# Altium schematic sheet Pressure_SENSOR.SchDoc
size A4
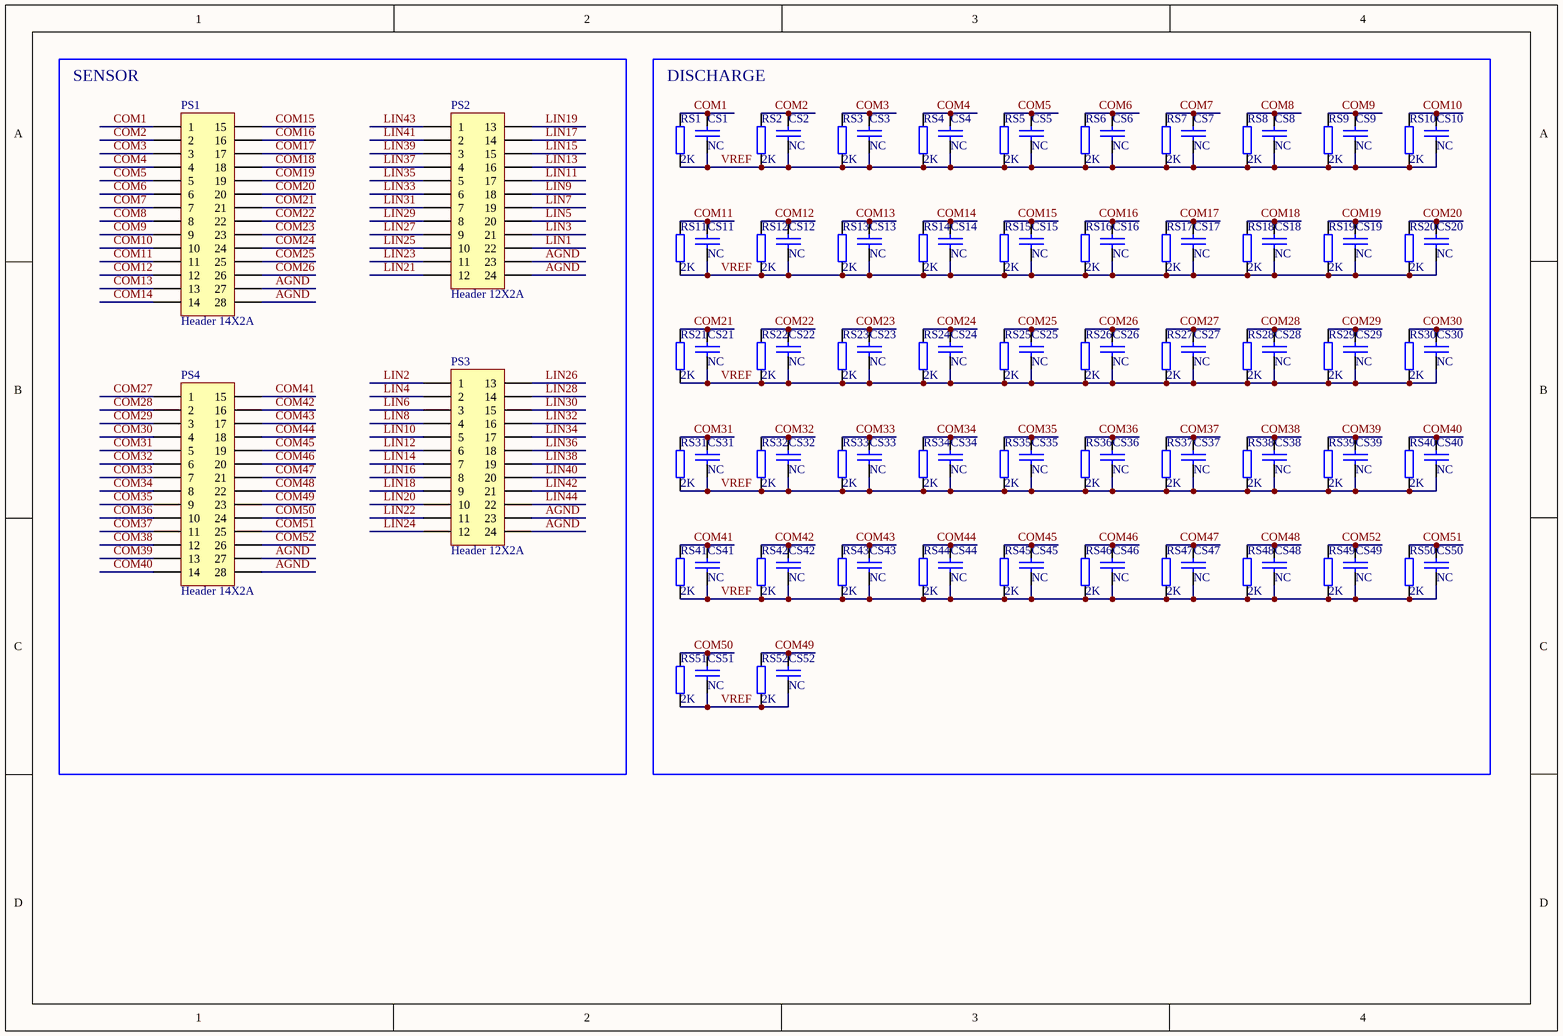
[diagram p0: Pressure_SENSOR.SchDoc]

## Parts
CS1  NC  [c0603_HSC100]
CS2  NC  [c0603_HSC100]
CS3  NC  [c0603_HSC100]
CS4  NC  [c0603_HSC100]
CS5  NC  [c0603_HSC100]
CS6  NC  [c0603_HSC100]
CS7  NC  [c0603_HSC100]
CS8  NC  [c0603_HSC100]
CS9  NC  [c0603_HSC100]
CS10  NC  [c0603_HSC100]
CS11  NC  [c0603_HSC100]
CS12  NC  [c0603_HSC100]
CS13  NC  [c0603_HSC100]
CS14  NC  [c0603_HSC100]
CS15  NC  [c0603_HSC100]
CS16  NC  [c0603_HSC100]
CS17  NC  [c0603_HSC100]
CS18  NC  [c0603_HSC100]
CS19  NC  [c0603_HSC100]
CS20  NC  [c0603_HSC100]
CS21  NC  [c0603_HSC100]
CS22  NC  [c0603_HSC100]
CS23  NC  [c0603_HSC100]
CS24  NC  [c0603_HSC100]
CS25  NC  [c0603_HSC100]
CS26  NC  [c0603_HSC100]
CS27  NC  [c0603_HSC100]
CS28  NC  [c0603_HSC100]
CS29  NC  [c0603_HSC100]
CS30  NC  [c0603_HSC100]
CS31  NC  [c0603_HSC100]
CS32  NC  [c0603_HSC100]
CS33  NC  [c0603_HSC100]
CS34  NC  [c0603_HSC100]
CS35  NC  [c0603_HSC100]
CS36  NC  [c0603_HSC100]
CS37  NC  [c0603_HSC100]
CS38  NC  [c0603_HSC100]
CS39  NC  [c0603_HSC100]
CS40  NC  [c0603_HSC100]
CS41  NC  [c0603_HSC100]
CS42  NC  [c0603_HSC100]
CS43  NC  [c0603_HSC100]
CS44  NC  [c0603_HSC100]
CS45  NC  [c0603_HSC100]
CS46  NC  [c0603_HSC100]
CS47  NC  [c0603_HSC100]
CS48  NC  [c0603_HSC100]
CS49  NC  [c0603_HSC100]
CS50  NC  [c0603_HSC100]
CS51  NC  [c0603_HSC100]
CS52  NC  [c0603_HSC100]
PS1  Header 14X2A  [FPC-1.0-26]
PS2  Header 12X2A  [FPC-1.0-22]
PS3  Header 12X2A  [FPC-1.0-22]
PS4  Header 14X2A  [FPC-1.0-26]
RS1  2K  [R0603_HSC100]
RS2  2K  [R0603_HSC100]
RS3  2K  [R0603_HSC100]
RS4  2K  [R0603_HSC100]
RS5  2K  [R0603_HSC100]
RS6  2K  [R0603_HSC100]
RS7  2K  [R0603_HSC100]
RS8  2K  [R0603_HSC100]
RS9  2K  [R0603_HSC100]
RS10  2K  [R0603_HSC100]
RS11  2K  [R0603_HSC100]
RS12  2K  [R0603_HSC100]
RS13  2K  [R0603_HSC100]
RS14  2K  [R0603_HSC100]
RS15  2K  [R0603_HSC100]
RS16  2K  [R0603_HSC100]
RS17  2K  [R0603_HSC100]
RS18  2K  [R0603_HSC100]
RS19  2K  [R0603_HSC100]
RS20  2K  [R0603_HSC100]
RS21  2K  [R0603_HSC100]
RS22  2K  [R0603_HSC100]
RS23  2K  [R0603_HSC100]
RS24  2K  [R0603_HSC100]
RS25  2K  [R0603_HSC100]
RS26  2K  [R0603_HSC100]
RS27  2K  [R0603_HSC100]
RS28  2K  [R0603_HSC100]
RS29  2K  [R0603_HSC100]
RS30  2K  [R0603_HSC100]
RS31  2K  [R0603_HSC100]
RS32  2K  [R0603_HSC100]
RS33  2K  [R0603_HSC100]
RS34  2K  [R0603_HSC100]
RS35  2K  [R0603_HSC100]
RS36  2K  [R0603_HSC100]
RS37  2K  [R0603_HSC100]
RS38  2K  [R0603_HSC100]
RS39  2K  [R0603_HSC100]
RS40  2K  [R0603_HSC100]
RS41  2K  [R0603_HSC100]
RS42  2K  [R0603_HSC100]
RS43  2K  [R0603_HSC100]
RS44  2K  [R0603_HSC100]
RS45  2K  [R0603_HSC100]
RS46  2K  [R0603_HSC100]
RS47  2K  [R0603_HSC100]
RS48  2K  [R0603_HSC100]
RS49  2K  [R0603_HSC100]
RS50  2K  [R0603_HSC100]
RS51  2K  [R0603_HSC100]
RS52  2K  [R0603_HSC100]

## Blocks framed on the sheet
SENSOR: PS1-PS4
DISCHARGE: CS1-CS52 RS1-RS52

## Nets
AGND: PS1.27 PS1.28 PS2.23 PS2.24 PS3.23 PS3.24 PS4.27 PS4.28
COM1: CS1.2 PS1.1 RS1.2
COM2: CS2.2 PS1.2 RS2.2
COM3: CS3.2 PS1.3 RS3.2
COM4: CS4.2 PS1.4 RS4.2
COM5: CS5.2 PS1.5 RS5.2
COM6: CS6.2 PS1.6 RS6.2
COM7: CS7.2 PS1.7 RS7.2
COM8: CS8.2 PS1.8 RS8.2
COM9: CS9.2 PS1.9 RS9.2
COM10: CS10.2 PS1.10 RS10.2
COM11: CS11.2 PS1.11 RS11.2
COM12: CS12.2 PS1.12 RS12.2
COM13: CS13.2 PS1.13 RS13.2
COM14: CS14.2 PS1.14 RS14.2
COM15: CS15.2 PS1.15 RS15.2
COM16: CS16.2 PS1.16 RS16.2
COM17: CS17.2 PS1.17 RS17.2
COM18: CS18.2 PS1.18 RS18.2
COM19: CS19.2 PS1.19 RS19.2
COM20: CS20.2 PS1.20 RS20.2
COM21: CS21.2 PS1.21 RS21.2
COM22: CS22.2 PS1.22 RS22.2
COM23: CS23.2 PS1.23 RS23.2
COM24: CS24.2 PS1.24 RS24.2
COM25: CS25.2 PS1.25 RS25.2
COM26: CS26.2 PS1.26 RS26.2
COM27: CS27.2 PS4.1 RS27.2
COM28: CS28.2 PS4.2 RS28.2
COM29: CS29.2 PS4.3 RS29.2
COM30: CS30.2 PS4.4 RS30.2
COM31: CS31.2 PS4.5 RS31.2
COM32: CS32.2 PS4.6 RS32.2
COM33: CS33.2 PS4.7 RS33.2
COM34: CS34.2 PS4.8 RS34.2
COM35: CS35.2 PS4.9 RS35.2
COM36: CS36.2 PS4.10 RS36.2
COM37: CS37.2 PS4.11 RS37.2
COM38: CS38.2 PS4.12 RS38.2
COM39: CS39.2 PS4.13 RS39.2
COM40: CS40.2 PS4.14 RS40.2
COM41: CS41.2 PS4.15 RS41.2
COM42: CS42.2 PS4.16 RS42.2
COM43: CS43.2 PS4.17 RS43.2
COM44: CS44.2 PS4.18 RS44.2
COM45: CS45.2 PS4.19 RS45.2
COM46: CS46.2 PS4.20 RS46.2
COM47: CS47.2 PS4.21 RS47.2
COM48: CS48.2 PS4.22 RS48.2
COM49: CS52.2 PS4.23 RS52.2
COM50: CS51.2 PS4.24 RS51.2
COM51: CS50.2 PS4.25 RS50.2
COM52: CS49.2 PS4.26 RS49.2
LIN1: PS2.22
LIN2: PS3.1
LIN3: PS2.21
LIN4: PS3.2
LIN5: PS2.20
LIN6: PS3.3
LIN7: PS2.19
LIN8: PS3.4
LIN9: PS2.18
LIN10: PS3.5
LIN11: PS2.17
LIN12: PS3.6
LIN13: PS2.16
LIN14: PS3.7
LIN15: PS2.15
LIN16: PS3.8
LIN17: PS2.14
LIN18: PS3.9
LIN19: PS2.13
LIN20: PS3.10
LIN21: PS2.12
LIN22: PS3.11
LIN23: PS2.11
LIN24: PS3.12
LIN25: PS2.10
LIN26: PS3.13
LIN27: PS2.9
LIN28: PS3.14
LIN29: PS2.8
LIN30: PS3.15
LIN31: PS2.7
LIN32: PS3.16
LIN33: PS2.6
LIN34: PS3.17
LIN35: PS2.5
LIN36: PS3.18
LIN37: PS2.4
LIN38: PS3.19
LIN39: PS2.3
LIN40: PS3.20
LIN41: PS2.2
LIN42: PS3.21
LIN43: PS2.1
LIN44: PS3.22
VREF: CS1.1 CS2.1 CS3.1 CS4.1 CS5.1 CS6.1 CS7.1 CS8.1 CS9.1 CS10.1 CS11.1 CS12.1 CS13.1 CS14.1 CS15.1 CS16.1 CS17.1 CS18.1 CS19.1 CS20.1 CS21.1 CS22.1 CS23.1 CS24.1 CS25.1 CS26.1 CS27.1 CS28.1 CS29.1 CS30.1 CS31.1 CS32.1 CS33.1 CS34.1 CS35.1 CS36.1 CS37.1 CS38.1 CS39.1 CS40.1 CS41.1 CS42.1 CS43.1 CS44.1 CS45.1 CS46.1 CS47.1 CS48.1 CS49.1 CS50.1 CS51.1 CS52.1 RS1.1 RS2.1 RS3.1 RS4.1 RS5.1 RS6.1 RS7.1 RS8.1 RS9.1 RS10.1 RS11.1 RS12.1 RS13.1 RS14.1 RS15.1 RS16.1 RS17.1 RS18.1 RS19.1 RS20.1 RS21.1 RS22.1 RS23.1 RS24.1 RS25.1 RS26.1 RS27.1 RS28.1 RS29.1 RS30.1 RS31.1 RS32.1 RS33.1 RS34.1 RS35.1 RS36.1 RS37.1 RS38.1 RS39.1 RS40.1 RS41.1 RS42.1 RS43.1 RS44.1 RS45.1 RS46.1 RS47.1 RS48.1 RS49.1 RS50.1 RS51.1 RS52.1

## Library data of the parts
CS1-CS52 = CAP: Capacitor
PS1 PS4 = Header 14X2A: Header, 14-Pin, Dual row; LatestRevisionDate: 17-Jul-2002; LatestRevisionNote: Re-released for DXP Platform.; Publisher: Altium Limited
PS2 PS3 = Header 12X2A: Header, 12-Pin, Dual row; LatestRevisionDate: 17-Jul-2002; LatestRevisionNote: Re-released for DXP Platform.; Publisher: Altium Limited
RS1-RS52 = RES